# Altium project Programmer.PrjPCB
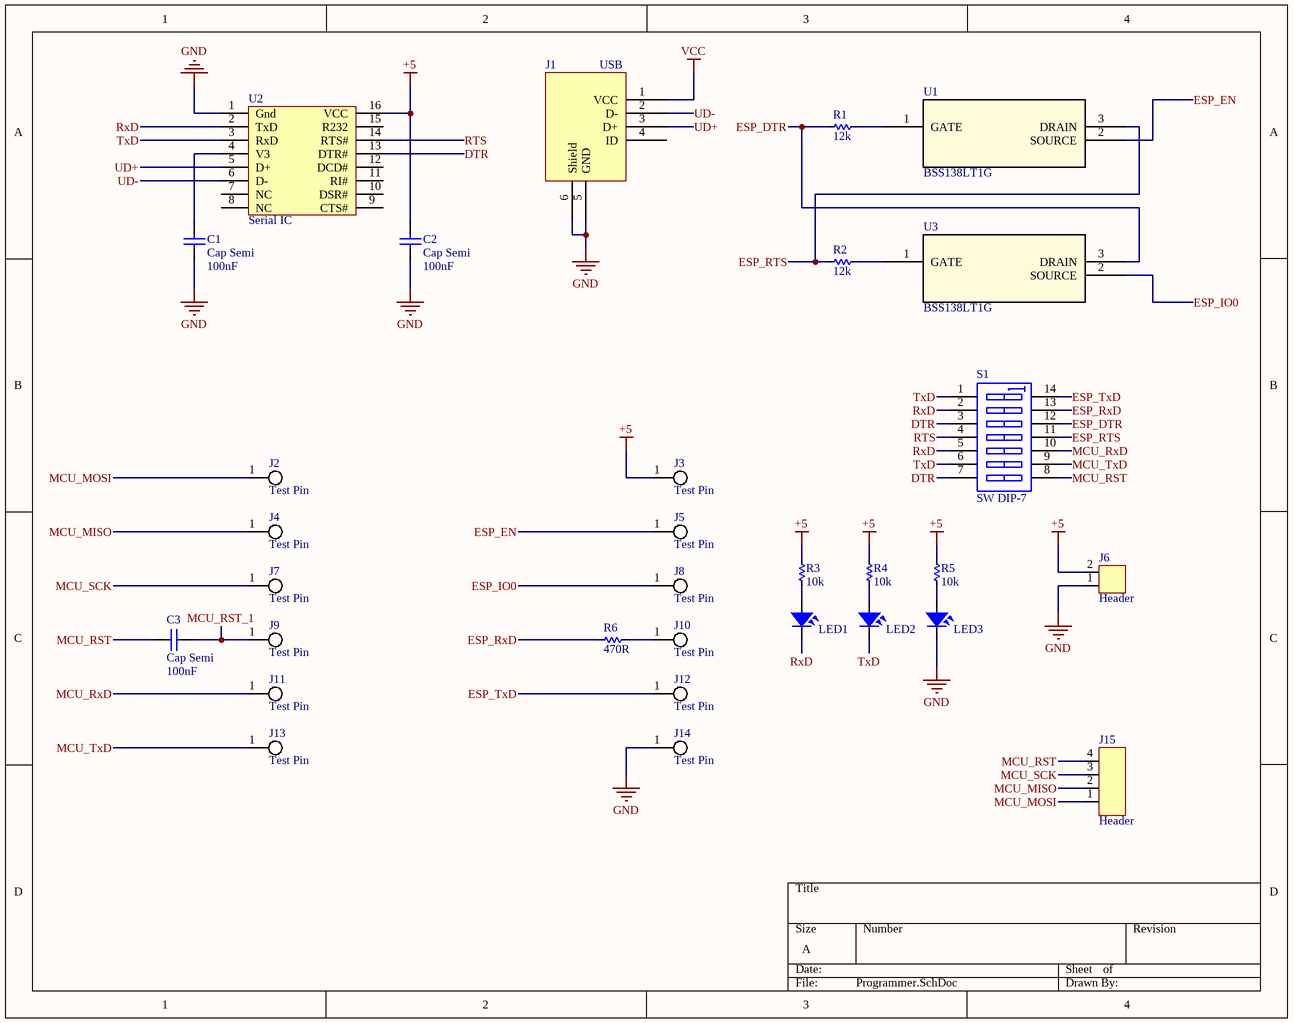
[diagram p0: Programmer.SchDoc]
1 sheet, 31 parts. Net scope: global (net labels, ports and power ports of the same name join across sheets).
Board file: Programmer.PcbDoc

## Sheet Programmer.SchDoc
size A

### Parts
C1  Cap Semi  value 100nF  [1608[0603]]
C2  Cap Semi  value 100nF  [1608[0603]]
C3  Cap Semi  value 100nF  [1608[0603]]
J1  USB  [USB-MICRO-B-1]
J2  Test Pin  [P50-J1]
J3  Test Pin  [P50-J1]
J4  Test Pin  [P50-J1]
J5  Test Pin  [P50-J1]
J6  Header  [Header 1x2 Pin 2.54mm]
J7  Test Pin  [P50-J1]
J8  Test Pin  [P50-J1]
J9  Test Pin  [P50-J1]
J10  Test Pin  [P50-J1]
J11  Test Pin  [P50-J1]
J12  Test Pin  [P50-J1]
J13  Test Pin  [P50-J1]
J14  Test Pin  [P50-J1]
J15  Header  [HEADER 1X4PIN 2.54mm]
LED1  LED  [LED-0805-Red]  (value not drawn)
LED2  LED  [LED-0805-Red]  (value not drawn)
LED3  LED  [LED-0805-Red]  (value not drawn)
R1  value 12k  [RES-SMD-0603]  (hidden comment: Res)
R2  value 12k  [RES-SMD-0603]  (hidden comment: Res)
R3  value 10k  [RES-SMD-0603]  (hidden comment: Res)
R4  value 10k  [RES-SMD-0603]  (hidden comment: Res)
R5  value 10k  [RES-SMD-0603]  (hidden comment: Res)
R6  value 470R  [RES-SMD-0603]  (hidden comment: Res)
S1  SW DIP-7  [DIP-14]
U1  BSS138LT1G  [SOT23-3_ONS]
U2  Serial IC  [CH340C]
U3  BSS138LT1G  [SOT23-3_ONS]

### Nets
+5: C2.2 J3.1 J6.2 R3.1 R4.1 R5.1 U2.16(VCC)
GND: C1.1 C2.1 J1.5(GND) J1.6(Shield) J6.1 J14.1 LED3.2 U2.1(Gnd)
VCC: J1.1(VCC)
DTR: S1.3(A3) S1.7(A7) U2.13(DTR#)
ESP_DTR: R1.1 S1.12(B3) U3.3(DRAIN)
ESP_EN: J5.1 U1.2(SOURCE)
ESP_IO0: J8.1 U3.2(SOURCE)
ESP_RTS: R2.1 S1.11(B4) U1.3(DRAIN)
ESP_RxD: R6.1 S1.13(B2)
ESP_TxD: J12.1 S1.14(B1)
MCU_MISO: J4.1 J15.2
MCU_MOSI: J2.1 J15.1
MCU_RST: C3.2 J15.4 S1.8(B7)
MCU_RST_1: C3.1 J9.1
MCU_RxD: J11.1 S1.10(B5)
MCU_SCK: J7.1 J15.3
MCU_TxD: J13.1 S1.9(B6)
RTS: S1.4(A4) U2.14(RTS#)
RxD: LED1.2 S1.2(A2) S1.5(A5) U2.2(TxD)
TxD: LED2.2 S1.1(A1) S1.6(A6) U2.3(RxD)
UD+: J1.3(D+) U2.5(D+)
UD-: J1.2(D-) U2.6(D-)
NetC1_2: C1.2 U2.4(V3)
NetJ10_1: J10.1 R6.2
NetLED1_1: LED1.1 R3.2
NetLED2_1: LED2.1 R4.2
NetLED3_1: LED3.1 R5.2
NetR1_2: R1.2 U1.1(GATE)
NetR2_2: R2.2 U3.1(GATE)

Not connected (* = marked no-connect by the designer): J1 4(ID); U2 7(NC) 8(NC) 9(CTS#) 10(DSR#) 11(RI#) 12(DCD#) 15(R232)

### Library data of the parts
C1-C3 = Cap Semi: Capacitor (Semiconductor SIM Model); Published: 8-Jun-2000; LatestRevisionDate: 29-May-2009; LatestRevisionNote: IPC-7351 Footprint Added.; PackageReference: C1206; Publisher: Altium Limited; PackageDescription: Chip Capacitor
J1 = USB-Micro-B_1: MicroUSB 5pin TypeB SMD; ComponentLink1Description: Thegioiic; ComponentLink1URL: https://thegioiic.com/products/cong-usb-micro-b-dau-cai-5pin-smd-v1
J2-J5 J7-J14 = P50-J1
J6 = Header 1x2Pin 2.54mm
J15 = Header 1x4Pin 2.54mm
LED1-LED3 = LED SMD: Value: LED 3 - 5 ly 2 Colour
R1-R6 = Res-SMD: Resistor; Manufacturer: Generic Components; Class: Passive; Published: 08/06/2000; Publisher: Altium Hobart Technology Centre
S1 = SW DIP-7: DIP Switch, 7 Position, SPST; Published: 24-Mar-1999; LatestRevisionDate: 17-Jul-2002; LatestRevisionNote: Re-released for DXP Platform.; PackageReference: DIP-14; Publisher: Altium Limited; Code_JEDEC: MO-001-AF
U1 U3 = BSS138LT1G: No Description Available; Vendor: ON Semiconductor; Built_By: EMA_Jessica; SourceLibrary: ON_Semiconductor_2019-12-30; Manufacturer_Part_Number: BSS138LT1G; Copyright: Copyright (C) 2018 Accelerated Designs. All rights reserved; RefDes: RefDes; Type: DEV
U2 = CH340C: Transceiver USB 2.0 2Mbps SOP-16_150mil USB ICs RoHS